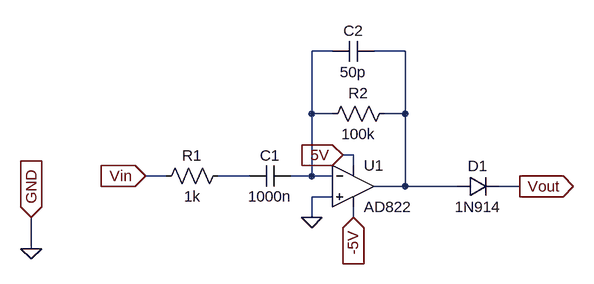
[diagram p0: schematic Differentiator.asc]
Differentiator.asc, the LTspice schematic file:
Version 4
SHEET 1 880 680
WIRE 64 -32 32 -32
WIRE 176 -32 128 -32
WIRE 32 64 32 -32
WIRE 64 64 32 64
WIRE 176 64 176 -32
WIRE 176 64 144 64
WIRE 96 128 80 128
WIRE 96 144 96 128
WIRE -192 160 -224 160
WIRE -64 160 -112 160
WIRE 32 160 32 64
WIRE 32 160 0 160
WIRE 64 160 32 160
WIRE 176 176 176 64
WIRE 176 176 128 176
WIRE 256 176 176 176
WIRE 352 176 320 176
WIRE 64 192 32 192
WIRE 32 224 32 192
WIRE 96 224 96 208
WIRE -400 272 -400 224
FLAG 32 224 0
FLAG 96 224 -5V
IOPIN 96 224 In
FLAG 80 128 5V
IOPIN 80 128 In
FLAG -224 160 Vin
IOPIN -224 160 In
FLAG 352 176 Vout
IOPIN 352 176 Out
FLAG -400 272 0
FLAG -400 224 GND
IOPIN -400 224 In
SYMBOL Opamps\\AD822 96 112 R0
SYMATTR InstName U1
SYMBOL res -96 144 R90
WINDOW 0 0 56 VBottom 2
WINDOW 3 32 56 VTop 2
SYMATTR InstName R1
SYMATTR Value 1k
SYMBOL cap 0 144 R90
WINDOW 0 0 32 VBottom 2
WINDOW 3 32 32 VTop 2
SYMATTR InstName C1
SYMATTR Value 1000n
SYMBOL cap 128 -48 R90
WINDOW 0 0 32 VBottom 2
WINDOW 3 32 32 VTop 2
SYMATTR InstName C2
SYMATTR Value 50p
SYMBOL res 160 48 R90
WINDOW 0 0 56 VBottom 2
WINDOW 3 32 56 VTop 2
SYMATTR InstName R2
SYMATTR Value 100k
SYMBOL diode 256 192 R270
WINDOW 0 32 32 VTop 2
WINDOW 3 0 32 VBottom 2
SYMATTR InstName D1
SYMATTR Value 1N914

The netlist it stands for:
* Differentiator.asc
XU1 0 N001 5V -5V N002 AD822  ; pins In+ In- V+ V- OUT
R1 N003 Vin 1k
C1 N001 N003 1000n
C2 N002 N001 50p
R2 N002 N001 100k
D1 N002 Vout 1N914
.model D D
.lib standard.dio
.backanno
.end